# Altium schematic sheet Ethernet_Connector.SchDoc
size A4; DocumentNumber: 10; SheetNumber: 10; SheetTotal: 11
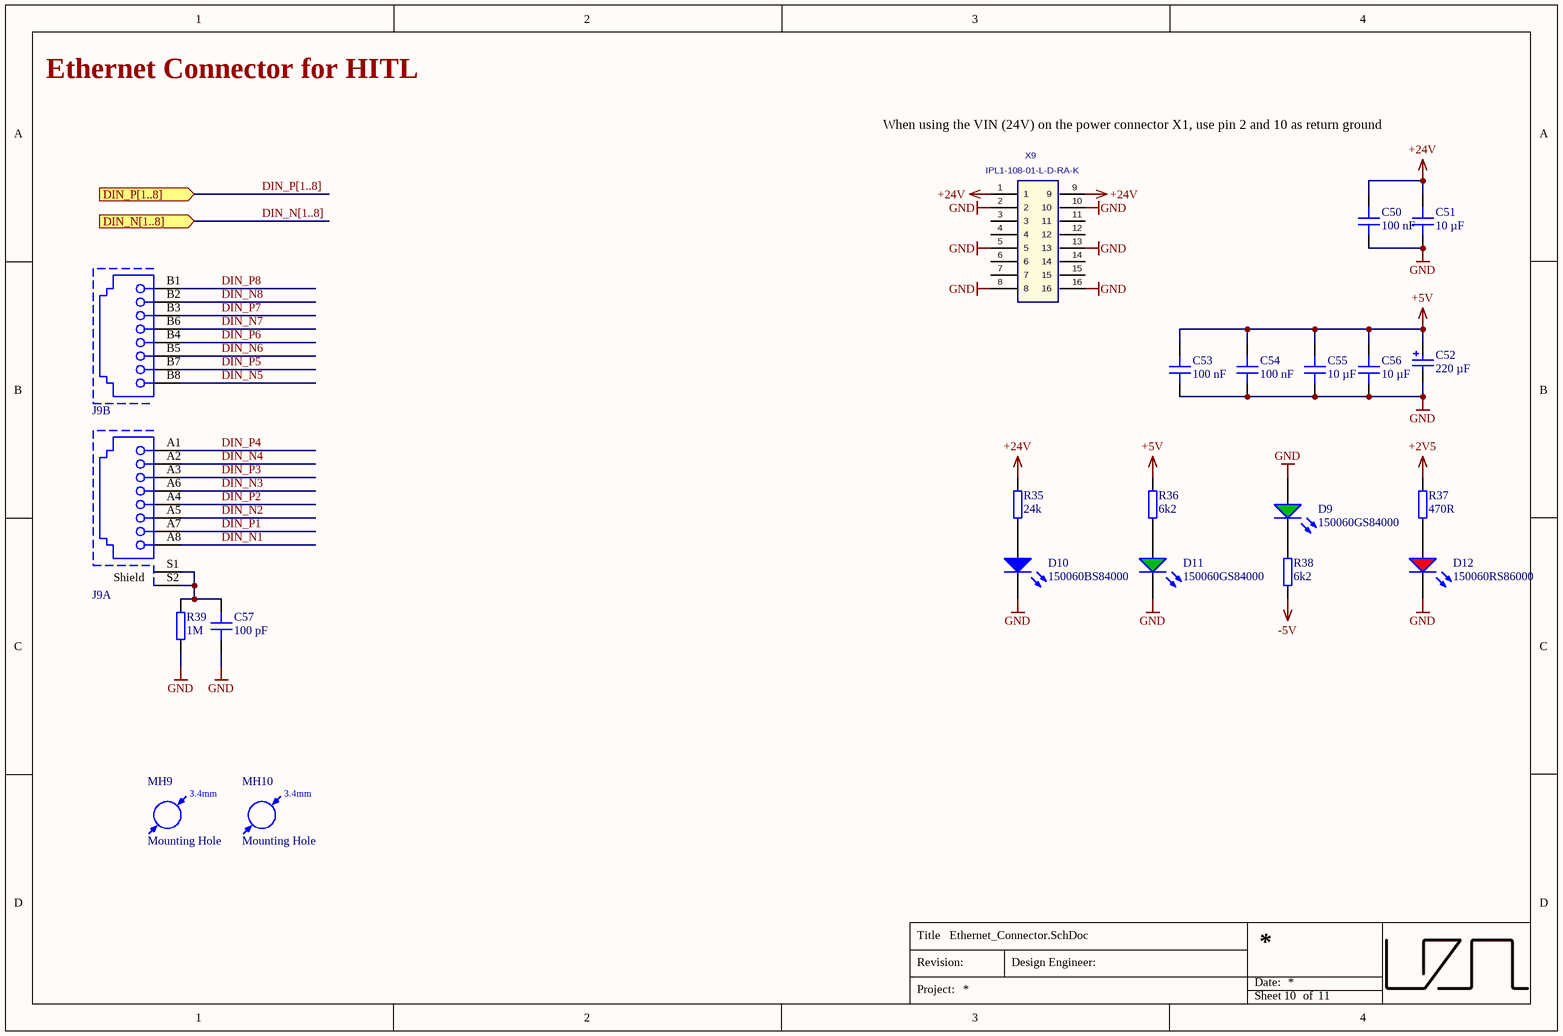
[diagram p0: Ethernet_Connector.SchDoc]

## Parts
C50  100 nF  [C_0603]
C51  10 µF  [C_1206]
C52  220 µF  [WCAP-PSHP_D8mm x L7.7mm]
C53  100 nF  [C_0603]
C54  100 nF  [C_0603]
C55  10 µF  [C_1206]
C56  10 µF  [C_1206]
C57  100 pF  [C_1206]
D9  150060GS84000  [WL-SMCW_0603]
D10  150060BS84000  [WL-SMCW_0603]
D11  150060GS84000  [WL-SMCW_0603]
D12  150060RS86000  [WL-SMCW_0603]
J9  RJHSE-5380-02  [RJHSE-5380-02]  (value not drawn)  (parts A,B of 2)
MH9  Mounting Hole  [MH_3.4]
MH10  Mounting Hole  [MH_3.4]
R35  24k  [RES 0603_1608]
R36  6k2  [RES 0603_1608]
R37  470R  [RES 0603_1608]
R38  6k2  [RES 0603_1608]
R39  1M  [RES 0603_1608]
X9  IPL1-108-01-L-D-RA-K  [IPL1-108-01-L-D-RA-K]

## Ports
DIN_N[1..8] (in), DIN_P[1..8] (in)

## Nets
+2V5: R37.2
+5V: C52.1(P) C53.2 C54.2 C55.2 C56.2 R36.2
+24V: C50.2 C51.2 R35.2 X9.1 X9.9
-5V: R38.1
GND: C50.1 C51.1 C52.2(N) C53.1 C54.1 C55.1 C56.1 C57.1 D9.2(A) D10.1(K) D11.1(K) D12.1(K) R39.1 X9.2 X9.5 X9.8 X9.10 X9.13 X9.16
DIN_N1: J9.A8
DIN_N2: J9.A5
DIN_N3: J9.A6
DIN_N4: J9.A2
DIN_N5: J9.B8
DIN_N6: J9.B5
DIN_N7: J9.B6
DIN_N8: J9.B2
DIN_P1: J9.A7
DIN_P2: J9.A4
DIN_P3: J9.A3
DIN_P4: J9.A1
DIN_P5: J9.B7
DIN_P6: J9.B4
DIN_P7: J9.B3
DIN_P8: J9.B1
NetC57_2: C57.2 J9.S1 J9.S2 R39.2
NetD9_1: D9.1(K) R38.2
NetD10_2: D10.2(A) R35.1
NetD11_2: D11.2(A) R36.1
NetD12_2: D12.2(A) R37.1

Not connected (* = marked no-connect by the designer): X9 3 4 6 7 11 12 14 15

## Buses and harness runs
bus DIN_N[1..8] = port DIN_N[1..8]
bus DIN_P[1..8] = port DIN_P[1..8]

## Notes on the sheet
- Ethernet Connector for HITL
- When using the VIN (24V) on the power connector X1, use pin 2 and 10 as return ground
- (near J9) Shield
- Title
- Revision:
- Design Engineer:
- Date:
- Project:
- Sheet
- of
- (in symbol Mounting Hole) 3.4mm

## Library data of the parts
C50 C53 C54 = C0603C104K9PACTU: Capacitor 0603, 6.3 VDC, 100 nF, X5R; Manufacturer: KEMET; Tolerance: 10 %; Voltage Rating: 6.3 VDC; Created from: MGremer; Manufacturer Part Number: C0603C104K9PACTU; PartID: 70; Created On: 20.12.2020 13:54:13; ComponentLink1Description: Datasheet; ComponentLink1URL: https://www.mouser.de/datasheet/2/212/KEM_C1006_X5R_SMD-1103249.pdf; Component Type: Capacitor 0603; Device Package: 0603; Last Updated: 20.01.2021 13:57:36; Mounting Type: SMD; Operating Temperature: -55 - 85°C; Series: SMD Comm X5R; Supplier 1: Mouser; Supplier Part Number 1: 80-C0603C104K9P; Type: Capacitor; Value: 100 nF; Live Cycle Status: 1; Stock number: not stored
C51 C55 C56 = GRT31CR61H106KE01L: Capacitor 1206, 50 VDC, 10 µF, X5R; Manufacturer: Murata Electronics; Tolerance: 10 %; Voltage Rating: 50 VDC; Created from: MGremer; Manufacturer Part Number: GRT31CR61H106KE01L; PartID: 65; Created On: 20.12.2020 13:54:13; ComponentLink1Description: Datasheet; ComponentLink1URL: https://www.mouser.de/datasheet/2/281/1/GRT31CR61H106KE01_01-1989724.pdf; Component Type: Capacitor 1206; Device Package: 1206; Last Updated: 20.12.2020 16:34:30; Mounting Type: SMD; Operating Temperature: -55 - 85°C; Series: GRT; Supplier 1: Mouser; Supplier Part Number 1: 81-GRT31CR61H106KE1L; Type: Capacitor; Value: 10 µF; Live Cycle Status: 1; Stock number: Labor SMD Container
C52 = 875115350002: Capacitor WCAP, 16 VDC, 220 µF; Manufacturer: Wuerth Elektronik; Tolerance: 20 %; Voltage Rating: 16 VDC; Created from: MGremer; Manufacturer Part Number: 875115350002; PartID: 33; Created On: 20.12.2020 13:54:13; ComponentLink1Description: Datasheet; ComponentLink1URL: https://www.mouser.de/datasheet/2/445/875115350002-1727170.pdf; Component Type: Capacitor WCAP; Device Package: WCAP-PSHP_D8mm x L7.7mm; Last Updated: 20.12.2020 17:44:37; Mounting Type: SMD; Operating Temperature: -55 - 105°C; Series: WCAP-PSHP; Supplier 1: Mouser; Supplier Part Number 1: 710-875115350002; Type: Capacitor; Value: 220 µF; Live Cycle Status: 1; Stock number: Labor SMD Container
C57 = 885342008009: Capacitor 1206, 1 kVDC, 100 pF, C0G; Manufacturer: Wuerth Elektronik; Tolerance: 5 %; Voltage Rating: 1 kVDC; Created from: MGremer; Manufacturer Part Number: 885342008009; PartID: 62; Created On: 20.12.2020 13:54:13; ComponentLink1Description: Datasheet; ComponentLink1URL: https://www.mouser.de/datasheet/2/445/885342008009-1727900.pdf; Component Type: Capacitor 1206; Device Package: 1206; Last Updated: 20.12.2020 17:44:37; Mounting Type: SMD; Operating Temperature: -55 - 125°C; Series: WCAP-CSMH; Supplier 1: Mouser; Supplier Part Number 1: 710-885342008009; Type: Capacitor; Value: 100 pF; Live Cycle Status: 1; Stock number: Labor SMD Container
D9 D11 = 150060GS84000: WL-SMCW SMD Mono-color Chip LED Waterclear Green; Manufacturer: Wuerth Elektronik; Type: Standard; Created from: MGremer; Forward Current I_f: 20 mA; Forward Voltage U_f: 3.2 V; Wavelength: 525 nm; Light Intensity: 3000 mcd; Nominal Power: 78 mW; Manufacturer Part Number: 150060GS84000; PartID: 2; Created On: 08.12.2020 10:41:11; ComponentLink1Description: Datasheet; ComponentLink1URL: https://www.mouser.de/datasheet/2/445/150060GS75020-1714345.pdf; Component Type: LED Diode; Device Package: 0603; Last Updated: 03.03.2021 09:59:51; Mounting Type: SMD; Operating Temperature: -40 - 85 °C; Supplier 1: Mouser; Supplier Part Number 1: 710-150060GS84000; Supplier 2: Farnell; Supplier Part Number 2: 3408612; Supplier 3: Digi-Key; Supplier Part Number 3: 732-150060GS84000CT-ND; Live Cycle Status: 1; Stock number: not stored; Color: green
D10 = 150060BS84000: WL-SMCW SMD Mono-color Chip LED Waterclear Blue; Manufacturer: Wuerth Elektronik; Type: Standard; Created from: MGremer; Forward Current I_f: 20 mA; Forward Voltage U_f: 3.2 V; Wavelength: 470 nm; Light Intensity: 560 mcd; Nominal Power: 78 mW; Manufacturer Part Number: 150060BS84000; PartID: 1; Created On: 08.12.2020 10:19:38; ComponentLink1Description: Datasheet; ComponentLink1URL: https://www.mouser.de/datasheet/2/445/150060BS84000-1838909.pdf; Component Type: LED Diode; Device Package: 0603; Last Updated: 03.03.2021 09:59:51; Mounting Type: SMD; Operating Temperature: -40 - 85 °C; Supplier 1: Mouser; Supplier Part Number 1: 710-150060BS84000; Supplier 2: Farnell; Supplier Part Number 2: 3408611; Supplier 3: Digi-Key; Supplier Part Number 3: 732-150060BS84000CT-ND; Live Cycle Status: 1; Stock number: not stored; Color: blue
D12 = 150060RS86000: WL-SMCW SMD Mono-color Chip LED Waterclear Red; Manufacturer: Wuerth Elektronik; Type: Standard; Created from: MGremer; Forward Current I_f: 20 mA; Forward Voltage U_f: 2 V; Wavelength: 624 nm; Light Intensity: 800 mcd; Nominal Power: 48 mW; Manufacturer Part Number: 150060RS86000; PartID: 3; Created On: 08.12.2020 10:48:12; ComponentLink1Description: Datasheet; ComponentLink1URL: https://www.mouser.de/datasheet/2/445/150120RS75000-1714636.pdf; Component Type: LED Diode; Device Package: 0603; Last Updated: 03.03.2021 09:59:52; Mounting Type: SMD; Operating Temperature: -40 - 85 °C; Supplier 1: Mouser; Supplier Part Number 1: 710-150060RS86000; Supplier 2: Farnell; Supplier Part Number 2: 3408608; Supplier 3: Digi-Key; Supplier Part Number 3: 732-150060RS86000CT-ND; Live Cycle Status: 1; Stock number: not stored; Color: red
J9 = RJHSE-5380-02: TAB-UP, MULTIPORT, RIGHT ANGLE OR VERTICAL WITH SHIELD AND INTEGRATED LEDs; MF: Amphenol; Pin Number: 8P8C; Port: 1x2; Compliance: Lead free / RoHS; Rated Current: 1.5 A; Working Voltage: 120 VAC; Withstanding Voltage: 1000 VAC; Contact Resistance: 20 mOhm; Created from: MHlatky; ComponentLink1Description: Datasheet; ComponentLink1URL: https://www.mouser.de/datasheet/2/18/1/io_modjack_rjhse-2509079.pdf; ComponentLink2Description: Datasheet; ComponentLink2URL: https://katalog.we-online.de/em/datasheet/615016137621.pdf; MPN: RJHSE-5380-02; Published Date: July 2018; Operating Temperature: -55 - 85; Mounting Technology: THT; Packaging: Tray; Entrance: Right Angle; Supplier 1: Mouser; Supplier Part Number 1: 523-RJHSE-5380-02; Manufacturer Part Number: RJHSE-5380-02; PartID: 8; Created On: 03.03.2022 16:53:36; Component Type: RJHSE-5380-02; Last Updated: 05.03.2022 21:01:46; Manufacturer: Amphenol; Mounting Type: Board Lock; Type: Ethernet Port; Live Cycle Status: 1
MH9 MH10 = Mounting Hole: Created from: MHlatky; Manufacturer Part Number: Mounting Hole; PartID: 16; Created On: 26.01.2021 09:19:51; ComponentLink1Description: Datasheet; Component Type: Mounting Hole; Device Package: -; Last Updated: 21.03.2022 23:05:12; Manufacturer: Mounting Hole; Supplier 1: Mounting Hole; Supplier Part Number 1: Mounting Hole; Type: Mounting Hole; Value: Mounting Hole; Live Cycle Status: 1; Stock number: not stored
R35 = RK73B1JTTD243J: SMD resistor E24 series; Manufacturer: KOA Speer; Tolerance: 5%; Created from: MGremer; Manufacturer Part Number: RK73B1JTTD243J; PartID: 107; Created On: 14.12.2020 16:17:14; ComponentLink1Description: Datasheet; ComponentLink1URL: https://www.mouser.de/datasheet/2/219/RK73B-1825463.pdf; Component Type: SMD resistor; Device Package: 0603; Last Updated: 02.03.2021 14:07:32; Mounting Type: SMD; Supplier 1: Mouser; Supplier Part Number 1: 660-RK73B1JTTD243J; Type: Resistor; Value: 24k; Live Cycle Status: 1; Stock number: Labor SMD Container
R36 R38 = RK73B1JTTD622J: SMD resistor E24 series; Manufacturer: KOA Speer; Tolerance: 5%; Created from: MGremer; Manufacturer Part Number: RK73B1JTTD622J; PartID: 93; Created On: 14.12.2020 16:17:14; ComponentLink1Description: Datasheet; ComponentLink1URL: https://www.mouser.de/datasheet/2/219/RK73B-1825463.pdf; Component Type: SMD resistor; Device Package: 0603; Last Updated: 02.03.2021 14:07:32; Mounting Type: SMD; Supplier 1: Mouser; Supplier Part Number 1: 660-RK73B1JTTD622J; Type: Resistor; Value: 6k2; Live Cycle Status: 1; Stock number: Labor SMD Container
R37 = RK73B1JTTD471J: SMD resistor E24 series; Manufacturer: KOA Speer; Tolerance: 5%; Created from: MGremer; Manufacturer Part Number: RK73B1JTTD471J; PartID: 66; Created On: 14.12.2020 16:17:14; ComponentLink1Description: Datasheet; ComponentLink1URL: https://www.mouser.de/datasheet/2/219/RK73B-1825463.pdf; Component Type: SMD resistor; Device Package: 0603; Last Updated: 04.03.2021 10:03:02; Mounting Type: SMD; Supplier 1: Mouser; Supplier Part Number 1: 660-RK73B1JTTD471J; Supplier 2: LCSC; Supplier Part Number 2: C23179; Type: Resistor; Value: 470R; Live Cycle Status: 1; Stock number: Labor SMD Container; LCSC Part Number: C23179
R39 = CRCW06031M00FKEAC: SMD resistor 1%; Manufacturer: Vishay / Dale; Created from: MGremer; Manufacturer Part Number: CRCW06031M00FKEAC; PartID: 179; Created On: 14.12.2020 16:17:14; ComponentLink1Description: Datasheet; ComponentLink1URL: https://www.mouser.de/datasheet/2/427/crcwce3-1762584.pdf; Component Type: SMD resistor; Device Package: 0603; Last Updated: 02.03.2021 14:07:32; Mounting Type: SMD; Supplier 1: Mouser; Supplier Part Number 1: 71-CRCW06031M00FKEAC; Type: Resistor; Tolerance: 1%; Value: 1M; Live Cycle Status: 1; Stock number: not stored
X9 = IPL1-108-01-L-D-RA-K: 2.54 mm Double Row Termin Assembly (right angle); Manufacturer: SAMTEC; Created from: MGremer; Number of positions: 8; Manufacturer Part Number: IPL1-108-01-L-D-RA-K; PartID: 17; Created On: 30.11.2020 10:36:28; ComponentLink1Description: Homepage; ComponentLink1URL: https://www.samtec.com/products/ipl1; Component Type: Samtec Connector; Device Package: Connector; Last Updated: 15.02.2021 09:17:39; Mounting Type: THT; Supplier 1: SAMTEC; Supplier Part Number 1: IPL1-108-01-L-D-RA-K; Type: Connector; Live Cycle Status: 1; Number of rows: 2; Stock number: not stored